# Altium schematic sheet 除臭.SchDoc
size A4
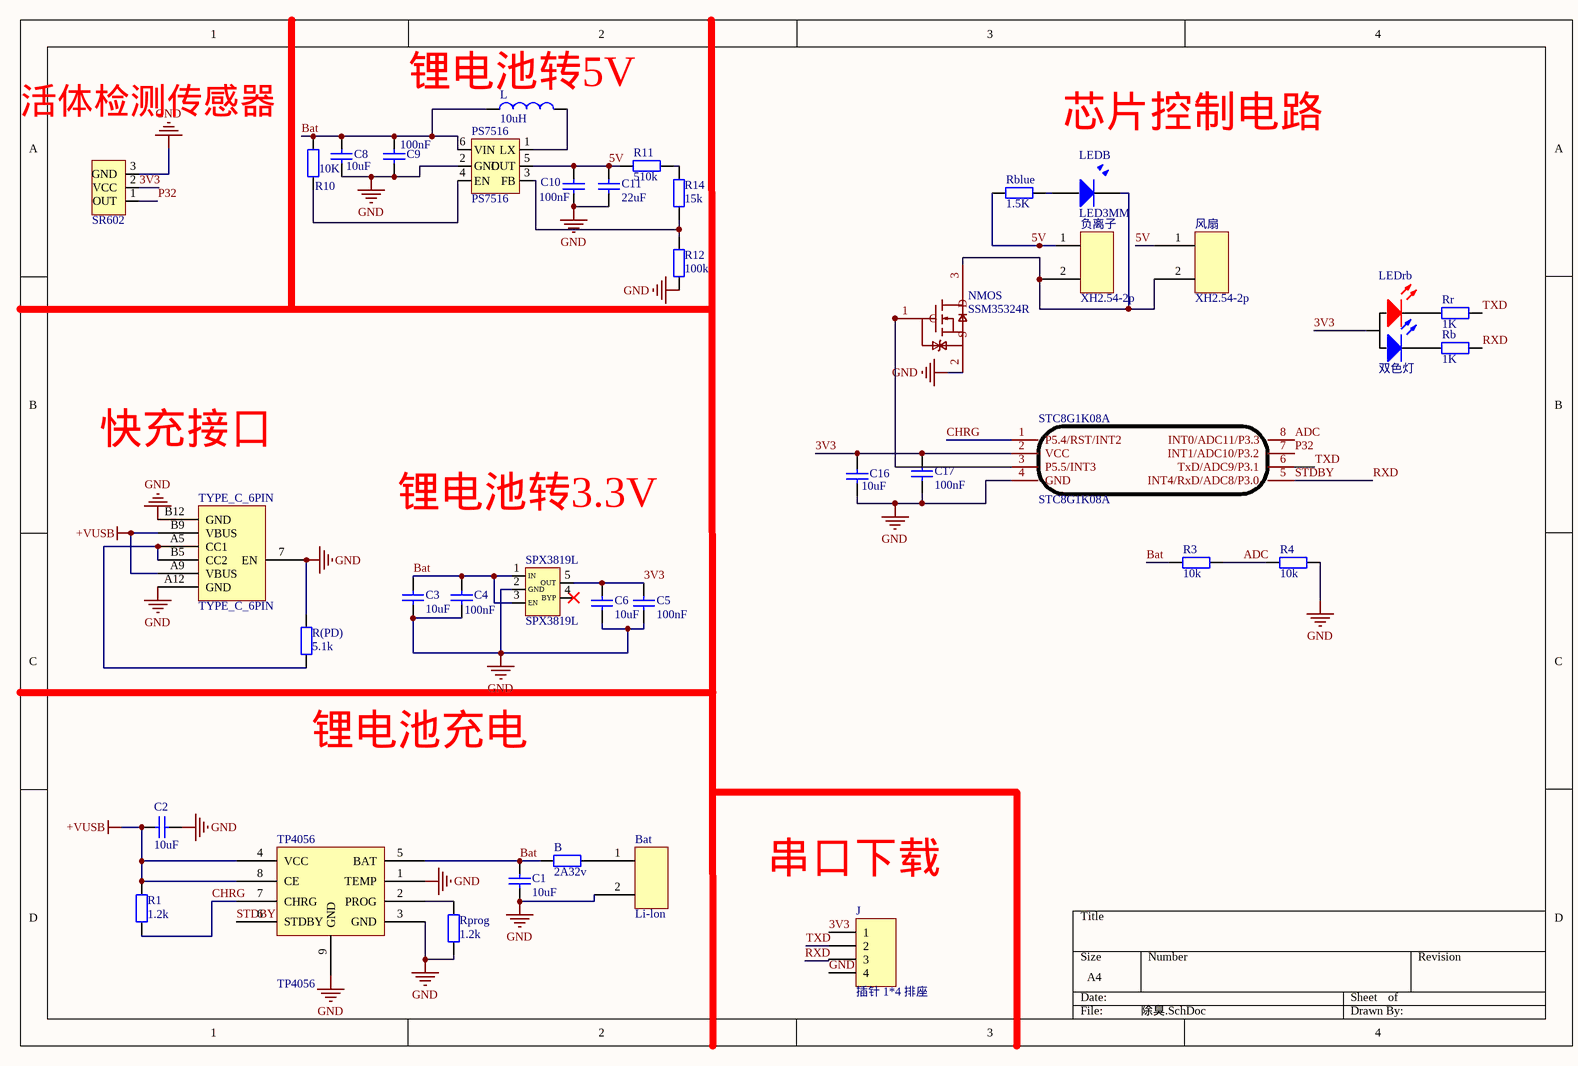
[diagram p0: 除臭.SchDoc]

## Parts
B  2A32v  [0603 电阻]
Bat  Li-lon  [XH-2.54-2p]
C1  10uF  [0603 电容]
C2  10uF  [0603 电容]
C3  10uF  [0603 电容]
C4  100nF  [0603 电容]
C5  100nF  [0603 电容]
C6  10uF  [0603 电容]
C8  10uF  [0603 电容]
C9  100nF  [0603 电容]
C10  100nF  [0603 电容]
C11  22uF  [0603 电容]
C16  10uF  [0603 电容]
C17  100nF  [0603 电容]
J  插针 1*4 排座  [插针1*4]
L  10uH  [电感 贴片 6*6]
LEDB  LED3MM  [LED3MM]
LEDrb  双色灯  [双色LED_F3]
NMOS  SSM35324R  [NOMOS]
PS7516  PS7516  [PS7516]
R1  1.2k  [0603 电阻]
R3  10k  [0603 电阻]
R4  10k  [0603 电阻]
R10  10K  [0603 电阻]
R11  510k  [0603 电阻]
R12  100k  [0603 电阻]
R14  15k  [0603 电阻]
R(PD)  5.1k  [0603 电阻]
Rb  1K  [0603 电阻]
Rblue  1.5K  [0603 电阻]
Rprog  1.2k  [0603 电阻]
Rr  1K  [0603 电阻]
SPX3819L  SPX3819L  [SPX3819]
SR602  SR602  [SR602]  (value not drawn)
STC8G1K08A  STC8G1K08A  [STC8G1K08A]
TP4056  TP4056  [TP4056]
TYPE_C_6PIN  TYPE_C_6PIN  [TYPE_C_PIN]
负离子  XH2.54-2p  [XH-2.54-2p]
风扇  XH2.54-2p  [XH-2.54-2p]

## Nets
+VUSB: C2.2 R1.2 TP4056.4(VCC) TP4056.8(CE) TYPE_C_6PIN.A9(VBUS) TYPE_C_6PIN.B9(VBUS)
GND: Bat.2 C1.1 C2.1 C3.1 C4.1 C5.1 C6.1 C8.1 C9.1 C10.1 C11.1 C16.1 C17.1 J.4 NMOS.2(S) PS7516.2(GND) R4.1 R12.1 R(PD).2 Rprog.1 SPX3819L.2(GND) SR602.3(GND) STC8G1K08A.4(GND) TP4056.1(TEMP) TP4056.3(GND) TP4056.9(GND) TYPE_C_6PIN.7(EN) TYPE_C_6PIN.A12(GND) TYPE_C_6PIN.B12(GND)
3V3: C5.2 C6.2 C16.2 C17.2 J.1 LEDrb.3(VCC) SPX3819L.5(OUT) SR602.2(VCC) STC8G1K08A.2(VCC)
5V: C10.2 C11.2 PS7516.5(OUT) R11.2 Rblue.2 负离子.1 风扇.1
ADC: R3.1 R4.2 STC8G1K08A.8(INT0/ADC11/P3.3)
Bat: B.1 C1.2 C3.2 C4.2 C8.2 C9.2 L.1 PS7516.6(VIN) R3.2 R10.2 SPX3819L.1(IN) SPX3819L.3(EN) TP4056.5(BAT)
CHRG: R1.1 STC8G1K08A.1(P5.4/RST/INT2) TP4056.7(CHRG)
P32: SR602.1(OUT) STC8G1K08A.7(INT1/ADC10/P3.2)
RXD: J.3 Rb.1 STC8G1K08A.5(INT4/RxD/ADC8/P3.0) TP4056.6(STDBY)  [also labelled STDBY]
TXD: J.2 Rr.1 STC8G1K08A.6(TxD/ADC9/P3.1)
NetB_2: B.2 Bat.1
NetL_2: L.2 PS7516.1(LX)
NetLEDB_1: LEDB.1 Rblue.1
NetLEDB_2: LEDB.2 NMOS.3(D) 负离子.2 风扇.2
NetLEDrb_1: LEDrb.1(R) Rr.2
NetLEDrb_2: LEDrb.2(B) Rb.2
NetNMOS_1: NMOS.1(G) STC8G1K08A.3(P5.5/INT3)
NetPS7516_3: PS7516.3(FB) R12.2 R14.2
NetPS7516_4: PS7516.4(EN) R10.1
NetR11_1: R11.1 R14.1
NetR(PD)_1: R(PD).1 TYPE_C_6PIN.A5(CC1) TYPE_C_6PIN.B5(CC2)
NetRprog_2: Rprog.2 TP4056.2(PROG)

Not connected (* = marked no-connect by the designer): SPX3819L 4(BYP)*

## Notes on the sheet
- 活体检测传感器
- (near L) 锂电池转5V
- 芯片控制电路
- 快充接口
- 锂电池转3.3V
- (near R(PD)) 锂电池充电
- (near J) 串口下载

## Library data of the parts
B R1 R3 R4 R10-R12 R14 R(PD) Rb Rblue Rprog Rr = 电阻
Bat = XH2.54-2p
C1-C6 C8-C11 C16 C17 = 电容 无极
L = 电感
NMOS = NMOS
SPX3819L = SPX3819LM